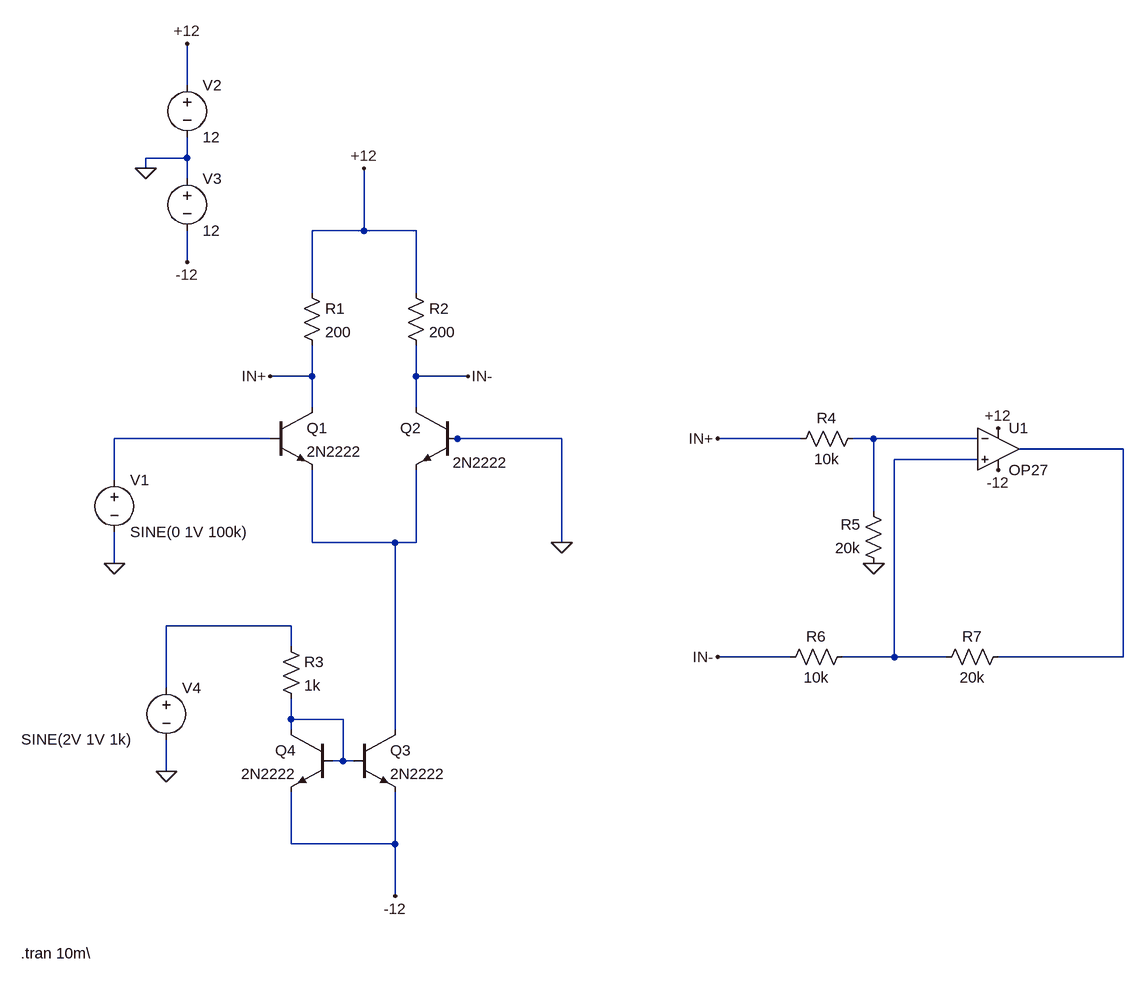
[diagram p0: schematic mul4.asc]
mul4.asc, the LTspice schematic file:
Version 4
SHEET 1 1728 1000
WIRE 16 -352 16 -416
WIRE 16 -240 16 -272
WIRE 16 -240 -48 -240
WIRE -48 -224 -48 -240
WIRE 16 -208 16 -240
WIRE 288 -128 288 -224
WIRE 288 -128 208 -128
WIRE 368 -128 288 -128
WIRE 16 -80 16 -128
WIRE 208 -32 208 -128
WIRE 368 -32 368 -128
WIRE 208 96 208 48
WIRE 208 96 144 96
WIRE 368 96 368 48
WIRE 448 96 368 96
WIRE 208 144 208 96
WIRE 368 144 368 96
WIRE 144 192 -96 192
WIRE 432 192 416 192
WIRE 592 192 432 192
WIRE 960 192 832 192
WIRE 1072 192 1040 192
WIRE 1232 192 1072 192
WIRE 1456 208 1296 208
WIRE 1232 224 1104 224
WIRE -96 256 -96 192
WIRE 1072 304 1072 192
WIRE 208 352 208 240
WIRE 336 352 208 352
WIRE 368 352 368 240
WIRE 368 352 336 352
WIRE 592 352 592 192
WIRE -96 384 -96 336
WIRE 176 480 -16 480
WIRE 176 512 176 480
WIRE 944 528 832 528
WIRE 1104 528 1104 224
WIRE 1104 528 1024 528
WIRE 1184 528 1104 528
WIRE 1456 528 1456 208
WIRE 1456 528 1264 528
WIRE -16 576 -16 480
WIRE 176 624 176 592
WIRE 256 624 176 624
WIRE 176 640 176 624
WIRE 336 640 336 352
WIRE 256 688 256 624
WIRE 256 688 240 688
WIRE 272 688 256 688
WIRE -16 704 -16 656
WIRE 176 816 176 736
WIRE 336 816 336 736
WIRE 336 816 176 816
WIRE 336 896 336 816
FLAG -96 384 0
FLAG -48 -224 0
FLAG 16 -416 +12
FLAG 16 -80 -12
FLAG 288 -224 +12
FLAG 336 896 -12
FLAG -16 704 0
FLAG 592 352 0
FLAG 144 96 IN+
FLAG 448 96 IN-
FLAG 1072 384 0
FLAG 832 192 IN+
FLAG 832 528 IN-
FLAG 1264 240 -12
FLAG 1264 176 +12
SYMBOL npn 144 144 R0
SYMATTR InstName Q1
SYMATTR Value 2N2222
SYMBOL npn 432 144 M0
WINDOW 3 -77 85 Left 2
SYMATTR InstName Q2
SYMATTR Value 2N2222
SYMBOL res 192 -48 R0
SYMATTR InstName R1
SYMATTR Value 200
SYMBOL res 352 -48 R0
SYMATTR InstName R2
SYMATTR Value 200
SYMBOL voltage -96 240 R0
WINDOW 123 0 0 Left 0
WINDOW 39 0 0 Left 0
SYMATTR InstName V1
SYMATTR Value SINE(0 1V 100k)
SYMBOL voltage 16 -368 R0
WINDOW 123 0 0 Left 0
WINDOW 39 0 0 Left 0
SYMATTR InstName V2
SYMATTR Value 12
SYMBOL voltage 16 -224 R0
WINDOW 123 0 0 Left 0
WINDOW 39 0 0 Left 0
SYMATTR InstName V3
SYMATTR Value 12
SYMBOL npn 240 640 M0
SYMATTR InstName Q4
SYMATTR Value 2N2222
SYMBOL npn 272 640 R0
SYMATTR InstName Q3
SYMATTR Value 2N2222
SYMBOL res 160 496 R0
SYMATTR InstName R3
SYMATTR Value 1k
SYMBOL voltage -16 560 R0
WINDOW 3 -223 95 Left 2
WINDOW 123 0 0 Left 0
WINDOW 39 0 0 Left 0
SYMATTR InstName V4
SYMATTR Value SINE(2V 1V 1k)
SYMBOL res 1056 176 R90
WINDOW 0 0 56 VBottom 2
WINDOW 3 32 56 VTop 2
SYMATTR InstName R4
SYMATTR Value 10k
SYMBOL res 1088 400 R180
WINDOW 0 36 76 Left 2
WINDOW 3 36 40 Left 2
SYMATTR InstName R5
SYMATTR Value 20k
SYMBOL res 928 544 R270
WINDOW 0 32 56 VTop 2
WINDOW 3 0 56 VBottom 2
SYMATTR InstName R6
SYMATTR Value 10k
SYMBOL res 1168 544 R270
WINDOW 0 32 56 VTop 2
WINDOW 3 0 56 VBottom 2
SYMATTR InstName R7
SYMATTR Value 20k
SYMBOL OpAmps\\OP27 1264 144 R0
SYMATTR InstName U1
TEXT -240 984 Left 2 !.tran 10m\\

The netlist it stands for:
* mul4.asc
Q1 IN+ N001 N005 0 2N2222
Q2 IN- 0 N005 0 2N2222
R1 +12 IN+ 200
R2 +12 IN- 200
V1 N001 0 SINE(0 1V 100k)
V2 +12 0 12
V3 0 -12 12
Q4 N007 N007 -12 0 2N2222
Q3 N005 N007 -12 0 2N2222
R3 N006 N007 1k
V4 N006 0 SINE(2V 1V 1k)
R4 N002 IN+ 10k
R5 0 N002 20k
R6 IN- N004 10k
R7 N004 N003 20k
XU1 N004 N002 +12 -12 N003 OP27  ; pins In+ In- V+ V- OUT
.model NPN NPN
.model PNP PNP
.lib standard.bjt
.tran 10m\
.lib ADI.lib
.backanno
.end